# Altium schematic sheet Remote_Connections.SchDoc
size A
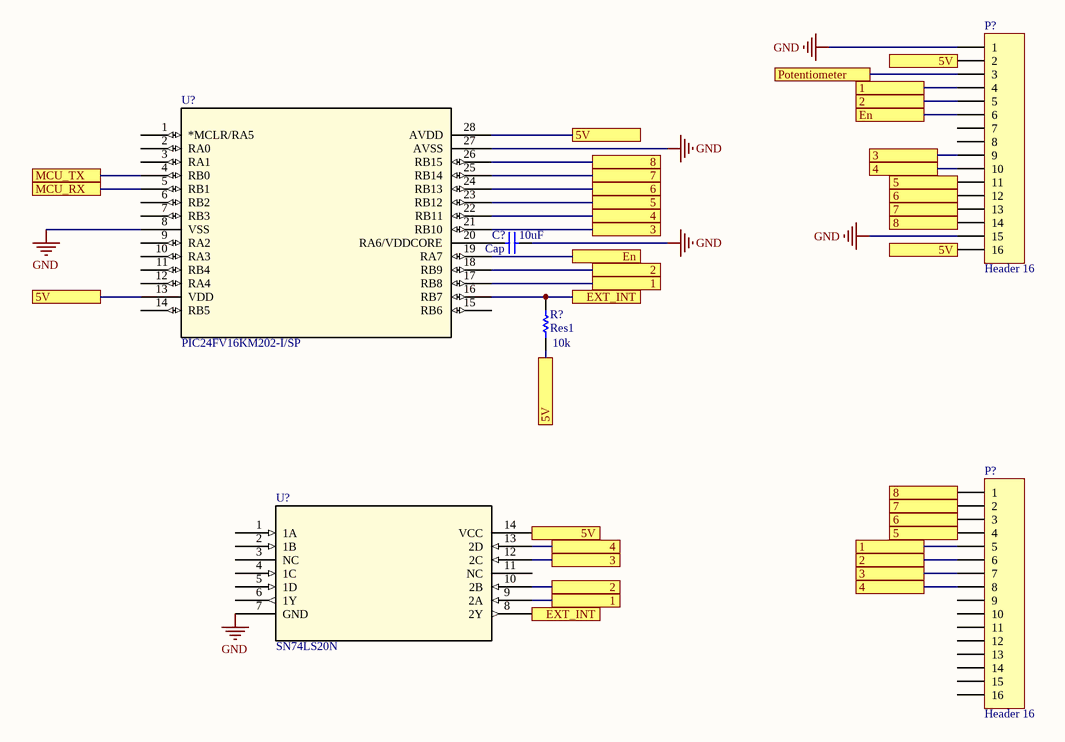
[diagram p0: Remote_Connections.SchDoc]

## Parts
(Parts that share a designator on the sheet are numbered #1, #2 ... from top to bottom, then left to right.)
C?  Cap  value 10uF  [RAD-0.3]
P?#1  Header 16  [HDR1X16]
P?#2  Header 16  [HDR1X16]
R?  Res1  value 10k  [AXIAL-0.3]
U?#1  PIC24FV16KM202-I/SP  [SPDIP28_300MC_MCH]
U?#2  SN74LS20N  [N14]

## Ports
1, 2, 3, 4, 5, 5V, 6, 7, 8, En, EXT_INT, MCU_RX, MCU_TX, Potentiometer

## Nets
GND: C?.2 P?#1.1 P?#1.15 U?#1.8(VSS) U?#1.27(AVSS) U?#2.7(GND)
1: P?#1.4 P?#2.5 U?#1.17(RB8) U?#2.9(2A) ; port 1
2: P?#1.5 P?#2.6 U?#1.18(RB9) U?#2.10(2B) ; port 2
3: P?#1.9 P?#2.7 U?#1.21(RB10) U?#2.12(2C) ; port 3
4: P?#1.10 P?#2.8 U?#1.22(RB11) U?#2.13(2D) ; port 4
5: P?#1.11 P?#2.4 U?#1.23(RB12) ; port 5
5V: P?#1.2 P?#1.16 R?.2 U?#1.13(VDD) U?#1.28(AVDD) U?#2.14(VCC) ; port 5V
6: P?#1.12 P?#2.3 U?#1.24(RB13) ; port 6
7: P?#1.13 P?#2.2 U?#1.25(RB14) ; port 7
8: P?#1.14 P?#2.1 U?#1.26(RB15) ; port 8
En: P?#1.6 U?#1.19(RA7) ; port En
EXT_INT: R?.1 U?#1.16(RB7) U?#2.8(2Y) ; port EXT_INT
MCU_RX: U?#1.5(RB1) ; port MCU_RX
MCU_TX: U?#1.4(RB0) ; port MCU_TX
Potentiometer: P?#1.3 ; port Potentiometer
NetC?_1: C?.1 U?#1.20(RA6/VDDCORE)

Not connected (* = marked no-connect by the designer): P?#1 7 8; P?#2 9 10 11 12 13 14 15 16; U?#1 1(*MCLR/RA5) 2(RA0) 3(RA1) 6(RB2) 7(RB3) 9(RA2) 10(RA3) 11(RB4) 12(RA4) 14(RB5) 15(RB6); U?#2 1(1A) 2(1B) 3(NC) 4(1C) 5(1D) 6(1Y) 11(NC)

## Library data of the parts
C? = Cap: Capacitor; Published: 8-Jun-2000; LatestRevisionDate: 17-Jul-2002; LatestRevisionNote: Re-released for DXP Platform.; PackageReference: RAD-0.3; Publisher: Altium Limited; PackageDescription: Radial Cap, Thru-Hole; 2 Leads; 0.3 in Pin Spacing
P?#1 P?#2 = Header 16: Header, 16-Pin; LatestRevisionDate: 17-Jul-2002; LatestRevisionNote: Re-released for DXP Platform.; Publisher: Altium Limited
R? = Res1: Resistor; Published: 8-Jun-2000; LatestRevisionDate: 17-Jul-2002; LatestRevisionNote: Re-released for DXP Platform.; PackageReference: AXIAL-0.3; Publisher: Altium Limited; PackageDescription: Axial Device, Thru-Hole; 2 Leads; 0.3 in Pin Spacing
U?#1 = PIC24FV16KM202-I/SP: No Description Available; Mfr_Name: Microchip; Copyright: Copyright (C) 2022 Ultra Librarian. All rights reserved.; Manufacturer_Part_Number: PIC24FV16KM202-I/SP; RefDes: RefDes; Type: DEV
U?#2 = SN74LS20N: No Description Available; Mfr_Name: Texas Instruments; Copyright: Copyright (C) 2022 Ultra Librarian. All rights reserved.; Manufacturer_Part_Number: SN74LS20N; RefDes: RefDes; Type: DEV